# Altium schematic sheet IRComms.SchDoc
size A
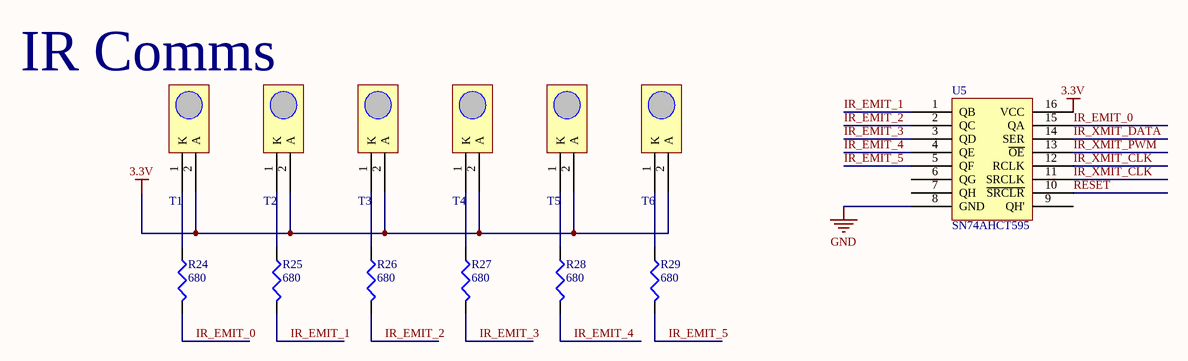
[diagram p0: IRComms.SchDoc]

## Parts
R24  value 680  [RESC1608L]  (hidden comment: Res3)
R25  value 680  [RESC1608L]  (hidden comment: Res3)
R26  value 680  [RESC1608L]  (hidden comment: Res3)
R27  value 680  [RESC1608L]  (hidden comment: Res3)
R28  value 680  [RESC1608L]  (hidden comment: Res3)
R29  value 680  [RESC1608L]  (hidden comment: Res3)
T1  LN54  [LN54]  (value not drawn)
T2  LN54  [LN54]  (value not drawn)
T3  LN54  [LN54]  (value not drawn)
T4  LN54  [LN54]  (value not drawn)
T5  LN54  [LN54]  (value not drawn)
T6  LN54  [LN54]  (value not drawn)
U5  SN74AHCT595  [TSSOP-16]

## Nets
3.3V: T1.2(A) T2.2(A) T3.2(A) T4.2(A) T5.2(A) T6.2(A) U5.16(VCC)
GND: U5.8(GND)
IR_EMIT_0: R24.2 U5.15(QA)
IR_EMIT_1: R25.2 U5.1(QB)
IR_EMIT_2: R26.2 U5.2(QC)
IR_EMIT_3: R27.2 U5.3(QD)
IR_EMIT_4: R28.2 U5.4(QE)
IR_EMIT_5: R29.2 U5.5(QF)
IR_XMIT_CLK: U5.11(SRCLK) U5.12(RCLK)
IR_XMIT_DATA: U5.14(SER)
IR_XMIT_PWM: U5.13(~{OE})
RESET: U5.10(~{SRCLR})
NetR24_1: R24.1 T1.1(K)
NetR25_1: R25.1 T2.1(K)
NetR26_1: R26.1 T3.1(K)
NetR27_1: R27.1 T4.1(K)
NetR28_1: R28.1 T5.1(K)
NetR29_1: R29.1 T6.1(K)

Not connected (* = marked no-connect by the designer): U5 6(QG) 7(QH) 9(QH')

## Notes on the sheet
- IR Comms

## Library data of the parts
R24-R29 = Res3: Resistor; Published: 8-Jun-2000; LatestRevisionDate: 29-May-2009; LatestRevisionNote: IPC-7351 Footprint Added.; PackageReference: J1-0603; Publisher: Altium Limited; PackageDescription: Chip Resistor
U5 = SN74AHCT595: shift register